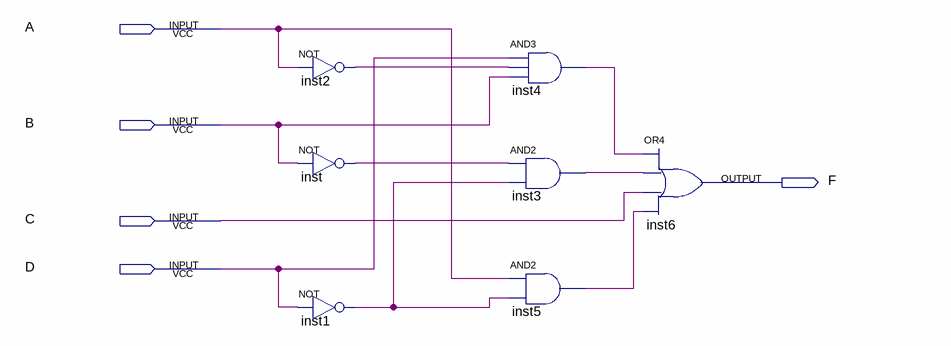
[diagram p0: schematic sheet]
// Quartus schematic func.bdf as structural Verilog: 7 symbols, 5 pins
module func (
  input  A,
  input  B,
  input  C,
  input  D,
  output F
);

  wire inst1_out, inst2_out, inst3_out, inst4_out, inst5_out, inst_out;

  not inst2 (inst2_out, A);
  not inst (inst_out, B);
  not inst1 (inst1_out, D);
  and inst4 (inst4_out, D, inst2_out, B);
  and inst3 (inst3_out, inst_out, inst1_out);
  and inst5 (inst5_out, A, inst1_out);
  or inst6 (F, inst4_out, inst3_out, C, inst5_out);
endmodule
